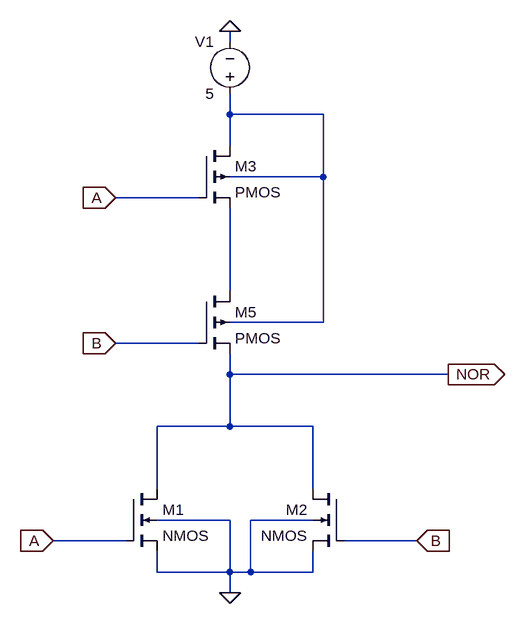
[diagram p0: schematic NOR.asc]
NOR.asc, the LTspice schematic file:
Version 4
SHEET 1 880 680
WIRE 272 -528 272 -544
WIRE 272 -416 272 -448
WIRE 416 -416 272 -416
WIRE 272 -368 272 -416
WIRE 416 -320 416 -416
WIRE 416 -320 272 -320
WIRE 224 -288 96 -288
WIRE 272 -144 272 -272
WIRE 416 -96 416 -320
WIRE 416 -96 272 -96
WIRE 224 -64 96 -64
WIRE 272 -16 272 -48
WIRE 608 -16 272 -16
WIRE 272 64 272 -16
WIRE 272 64 160 64
WIRE 400 64 272 64
WIRE 160 160 160 64
WIRE 400 160 400 64
WIRE 272 208 160 208
WIRE 400 208 304 208
WIRE 112 240 0 240
WIRE 560 240 448 240
WIRE 160 288 160 256
WIRE 272 288 272 208
WIRE 272 288 160 288
WIRE 304 288 304 208
WIRE 304 288 272 288
WIRE 400 288 400 256
WIRE 400 288 304 288
WIRE 272 320 272 288
FLAG 272 320 0
FLAG 0 240 A
IOPIN 0 240 In
FLAG 96 -288 A
IOPIN 96 -288 In
FLAG 96 -64 B
IOPIN 96 -64 In
FLAG 560 240 B
IOPIN 560 240 In
FLAG 608 -16 NOR
IOPIN 608 -16 Out
FLAG 272 -544 0
SYMBOL voltage 272 -432 R180
WINDOW 0 24 96 Left 2
WINDOW 3 24 16 Left 2
WINDOW 123 0 0 Left 0
WINDOW 39 0 0 Left 0
SYMATTR InstName V1
SYMATTR Value 5
SYMBOL pmos4 224 -144 R0
SYMATTR InstName M5
SYMBOL pmos4 224 -368 R0
SYMATTR InstName M3
SYMBOL nmos4 112 160 R0
SYMATTR InstName M1
SYMBOL nmos4 448 160 M0
SYMATTR InstName M2

The netlist it stands for:
* NOR.asc
V1 N001 0 5
M5 N002 B NOR N001 PMOS
M3 N001 A N002 N001 PMOS
M1 NOR A 0 0 NMOS
M2 NOR B 0 0 NMOS
.model NMOS NMOS
.model PMOS PMOS
.lib standard.mos
.backanno
.end